# Altium project pca10005.PrjPCB
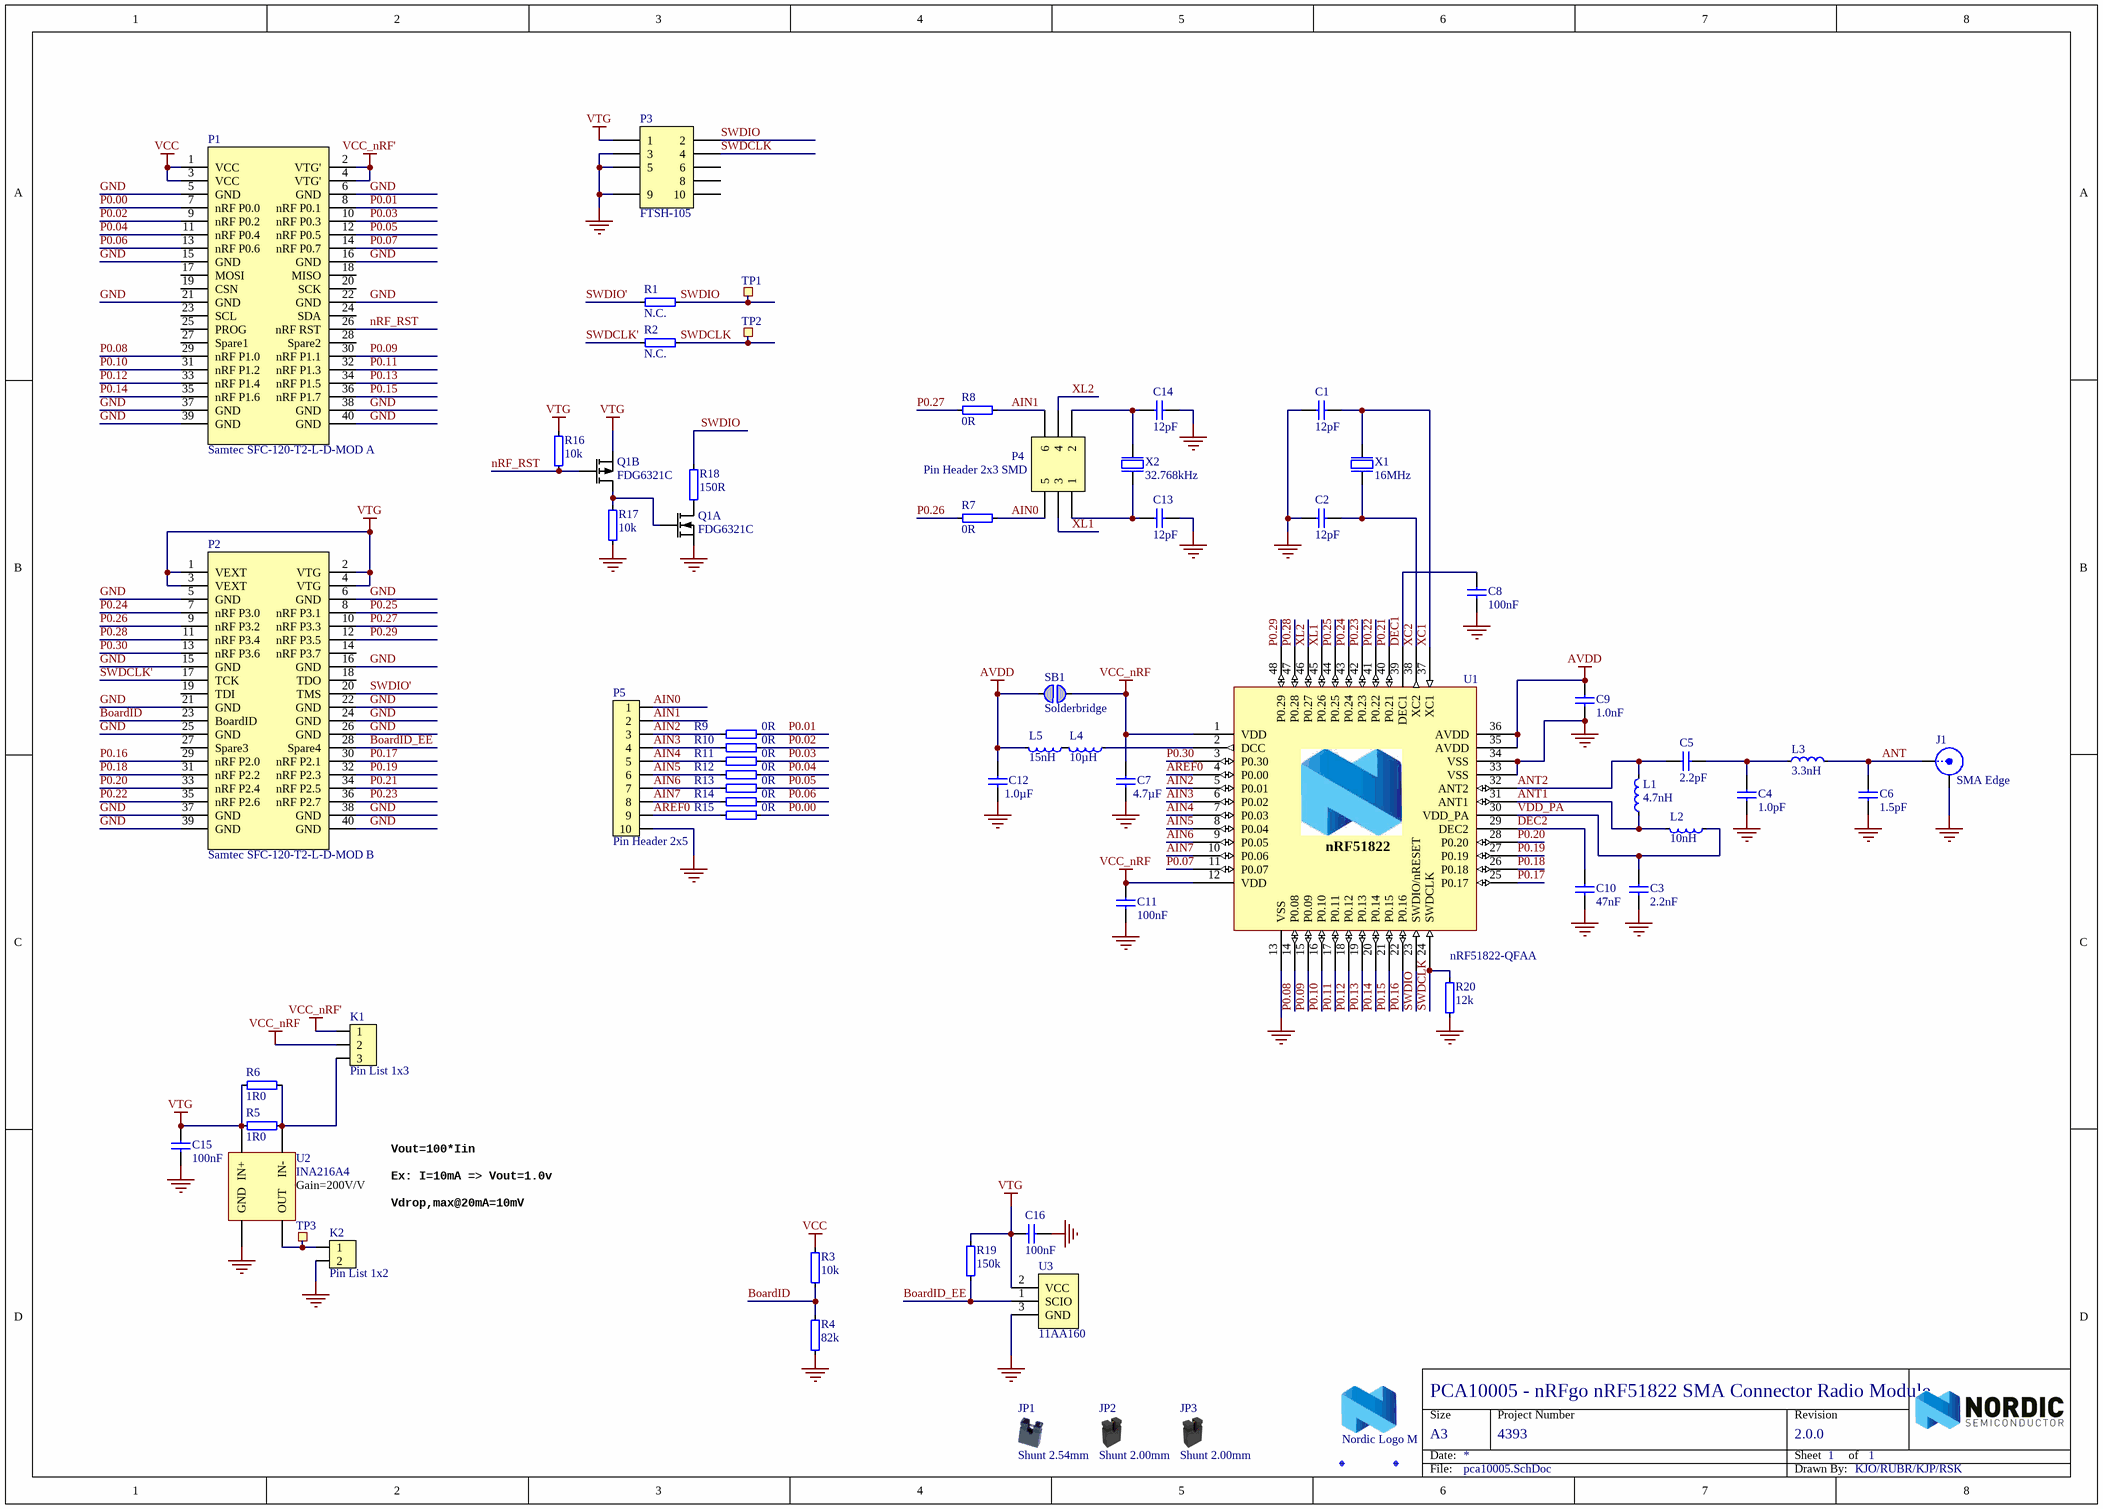
[diagram p0: pca10005.SchDoc]
1 sheet, 65 parts. Net scope: global (net labels, ports and power ports of the same name join across sheets).
Board file: 400006.PcbDoc

## Sheet pca10005.SchDoc: PCA10005 - nRFgo nRF51822 SMA Connector Radio Module
size A3; Revision: 2.0.0; SheetNumber: 1; SheetTotal: 1; DrawnBy: KJO/RUBR/KJP/RSK; ProjectNumber: 4393; DocumentSize: A3; PCBRevision: 0055RSK; PCBNumber: 400006; PCAName: PCA10005

### Parts
C1  12pF  [CAPC1005X04L]
C2  12pF  [CAPC1005X04L]
C3  2.2nF  [CAPC1005X04L]
C4  1.0pF  [CAPC1005X04L]
C5  2.2pF  [CAPC1005X04L]
C6  1.5pF  [CAPC1005X04L]
C7  4.7µF  [CAPC1608X06L]
C8  100nF  [CAPC1005X04L]
C9  1.0nF  [CAPC1005X04L]
C10  47nF  [CAPC1005X04L]
C11  100nF  [CAPC1005X04L]
C12  1.0µF  [CAPC1608X06L]
C13  12pF  [CAPC1005X04L]
C14  12pF  [CAPC1005X04L]
C15  100nF  [CAPC1005X04L]
C16  100nF  [CAPC1005X04L]
Fid1  Fiducial mark  [Fiducial]  (value not drawn)
Fid2  Fiducial mark  [Fiducial]  (value not drawn)
J1  SMA Edge  [SMA-Edge]
JP1  Shunt 2.54mm  [Shunt_2.54mm]
JP2  Shunt 2.00mm  [Shunt_2.00mm]
JP3  Shunt 2.00mm  [Shunt_2.00mm]
K1  Pin List 1x3  [LIST_1x3]
K2  Pin List 1x2  [LIST_1x2]
L1  4.7nH  [INDC1005X04L]
L2  10nH  [INDC1005X04L]
L3  3.3nH  [INDC1005X04L]
L4  10µH  [INDC1608X06L]
L5  15nH  [INDC1005X04L]
LOGO  Nordic Logo M  [NORDIC_LOGO_M]  (no BOM)
P1  Samtec SFC-120-T2-L-D-MOD A  [Samtec SFC-120-T2-L-D]
P2  Samtec SFC-120-T2-L-D-MOD B  [Samtec SFC-120-T2-L-D]
P3  FTSH-105  [HDR_2x5-SMD-1.27mm-SWD]
P4  Pin Header 2x3 SMD  [HDR-2x3-SMD-2.0mm]
P5  Pin Header 2x5  [HDR_2x5]
Q1  FDG6321C  [SC70-6]  (parts A,B of 2)
R1  N.C.  [RESC1005X04L]
R2  N.C.  [RESC1005X04L]
R3  10k  [RESC1005X04L]
R4  82k  [RESC1005X04L]
R5  1R0  [RESC1005X04L]
R6  1R0  [RESC1005X04L]
R7  0R  [RESC1005X04L]
R8  0R  [RESC1005X04L]
R9  0R  [RESC1005X04L]
R10  0R  [RESC1005X04L]
R11  0R  [RESC1005X04L]
R12  0R  [RESC1005X04L]
R13  0R  [RESC1005X04L]
R14  0R  [RESC1005X04L]
R15  0R  [RESC1005X04L]
R16  10k  [RESC1005X04L]
R17  10k  [RESC1005X04L]
R18  150R  [RESC1005X04L]
R19  150k  [RESC1005X04L]
R20  12k  [RESC1005X04L]
SB1  Solderbridge  [Solderbridge]  (no BOM)
TP1  SWDIO  [TP_SMD_1.0mmX1.0mm]  (value not drawn)  (no BOM)
TP2  SWDCLK  [TP_SMD_1.0mmX1.0mm]  (value not drawn)  (no BOM)
TP3  1.0mm,SMD  [TP_SMD_1.0mmX1.0mm]  (value not drawn)  (no BOM)
U1  nRF51822-QFAA  [QFN40P600X600X90-48N]
U2  INA216A4  [BGA4C40P2X2_76X76X62]
U3  11AA160  [SOT-23a]
X1  16MHz  [BT-XTAL_2520]
X2  32.768kHz  [FC-135]

### Nets
AVDD: C9.1 C12.1 L5.2 SB1.2 U1.35(AVDD) U1.36(AVDD)
GND: C1.2 C2.2 C3.2 C4.2 C6.2 C7.2 C8.2 C9.2 C10.2 C11.2 C12.2 C13.2 C14.2 C15.2 C16.2 J1.2(Y) K2.2 P1.5(GND) P1.6(GND) P1.15(GND) P1.16(GND) P1.21(GND) P1.22(GND) P1.37(GND) P1.38(GND) P1.39(GND) P1.40(GND) P2.5(GND) P2.6(GND) P2.15(GND) P2.16(GND) P2.21(GND) P2.22(GND) P2.24(GND) P2.25(GND) P2.26(GND) P2.37(GND) P2.38(GND) P2.39(GND) P2.40(GND) P3.3 P3.5 P3.9 P5.10 Q1.1(S1) R4.1 R17.2 R20.2 U1.13(VSS) U1.33(VSS) U1.34(VSS) U1.49 U2.B1(GND) U3.3(GND) X1.2(GND) X1.4(GND)
VCC: P1.1(VCC) P1.3(VCC) R3.2
VCC_nRF: C7.1 C11.1 K1.2 SB1.1 U1.1(VDD) U1.12(VDD)
VCC_nRF': K1.1 P1.2(VTG') P1.4(VTG')
VTG: C15.1 C16.1 P2.1(VEXT) P2.2(VTG) P2.3(VEXT) P2.4(VTG) P3.1 Q1.4(S2) R5.2 R6.2 R16.1 R19.2 U2.A1(IN+) U3.2(VCC)
AIN0: P4.5 P5.1 R7.2
AIN1: P4.6 P5.2 R8.2
AIN2: P5.3 R9.1 U1.5(P0.01)
AIN3: P5.4 R10.1 U1.6(P0.02)
AIN4: P5.5 R11.1 U1.7(P0.03)
AIN5: P5.6 R12.1 U1.8(P0.04)
AIN6: P5.7 R13.1 U1.9(P0.05)
AIN7: P5.8 R14.1 U1.10(P0.06)
ANT: C6.1 J1.1(X) L3.2
ANT1: L1.1 L2.2 U1.31(ANT1)
ANT2: C5.1 L1.2 U1.32(ANT2)
AREF0: P5.9 R15.1 U1.4(P0.00)
BoardID: P2.23(BoardID) R3.1 R4.2
BoardID_EE: P2.28(Spare4) R19.1 U3.1(SCIO)
DEC1: C8.1 U1.39(DEC1)
DEC2: C10.1 U1.29(DEC2)
nRF_RST: P1.26(nRF_RST) Q1.5(G2) R16.2
P0.00: P1.7(nRF_P0.0) R15.2
P0.01: P1.8(nRF_P0.1) R9.2
P0.02: P1.9(nRF_P0.2) R10.2
P0.03: P1.10(nRF_P0.3) R11.2
P0.04: P1.11(nRF_P0.4) R12.2
P0.05: P1.12(nRF_P0.5) R13.2
P0.06: P1.13(nRF_P0.6) R14.2
P0.07: P1.14(nRF_P0.7) U1.11(P0.07)
P0.08: P1.29(nRF_P1.0) U1.14(P0.08)
P0.09: P1.30(nRF_P1.1) U1.15(P0.09)
P0.10: P1.31(nRF_P1.2) U1.16(P0.10)
P0.11: P1.32(nRF_P1.3) U1.17(P0.11)
P0.12: P1.33(nRF_P1.4) U1.18(P0.12)
P0.13: P1.34(nRF_P1.5) U1.19(P0.13)
P0.14: P1.35(nRF_P1.6) U1.20(P0.14)
P0.15: P1.36(nRF_P1.7) U1.21(P0.15)
P0.16: P2.29(nRF_P2.0) U1.22(P0.16)
P0.17: P2.30(nRF_P2.1) U1.25(P0.17)
P0.18: P2.31(nRF_P2.2) U1.26(P0.18)
P0.19: P2.32(nRF_P2.3) U1.27(P0.19)
P0.20: P2.33(nRF_P2.4) U1.28(P0.20)
P0.21: P2.34(nRF_P2.5) U1.40(P0.21)
P0.22: P2.35(nRF_P2.6) U1.41(P0.22)
P0.23: P2.36(nRF_P2.7) U1.42(P0.23)
P0.24: P2.7(nRF_P3.0) U1.43(P0.24)
P0.25: P2.8(nRF_P3.1) U1.44(P0.25)
P0.26: P2.9(nRF_P3.2) R7.1
P0.27: P2.10(nRF_P3.3) R8.1
P0.28: P2.11(nRF_P3.4) U1.47(P0.28)
P0.29: P2.12(nRF_P3.5) U1.48(P0.29)
P0.30: P2.13(nRF_P3.6) U1.3(P0.30)
SWDCLK: P3.4 R2.1 R20.1 TP2.1 U1.24(SWDCLK)
SWDCLK': P2.17(TCK) R2.2
SWDIO: P3.2 R1.1 R18.1 TP1.1 U1.23(SWDIO/nRESET)
SWDIO': P2.20(TMS) R1.2
VDD_PA: C3.1 L2.1 U1.30(VDD_PA)
XC1: C1.1 U1.37(XC1) X1.1(inp)
XC2: C2.1 U1.38(XC2) X1.3(out)
XL1: P4.3 U1.45(P0.26)
XL2: P4.4 U1.46(P0.27)
NetC4_1: C4.1 C5.2 L3.1
NetC13_1: C13.1 P4.1 X2.2(out)
NetC14_1: C14.1 P4.2 X2.1(inp)
NetK1_3: K1.3 R5.1 R6.1 U2.A2(IN-)
NetK2_1: K2.1 TP3.1 U2.B2(OUT)
NetL4_1: L4.1 U1.2(DCC)
NetL4_2: L4.2 L5.1
NetQ1_2: Q1.2(G1) Q1.3(D2) R17.1
NetQ1_6: Q1.6(D1) R18.2

Not connected (* = marked no-connect by the designer): P1 17(MOSI) 18(MISO) 19(CSN) 20(SCK) 23(SCL) 24(SDA) 25(PROG) 27(Spare1) 28(Spare2); P2 14(nRF_P3.7) 18(TDO) 19(TDI) 27(Spare3); P3 6 8 10

### Notes on the sheet
- (near U2) Gain=200V/V
- Vout=100*Iin
  Ex: I=10mA => Vout=1.0v
  Vdrop,max@20mA=10mV
- Size
- Date:
- Project Number
- Sheet         of
- Revision
- File:
- Drawn By:
- (in symbol nRF51822-Q48-6x6_DCDC) nRF51822

### Library data of the parts
C1 C2 C13 C14 = C0402-12p: Capacitor, NP0, ±2%; Note: 50V; Artikkelnr Noca: 20029159; Part Number: C0402-12p; Manufacturer: *; Manufacturer Part Number: *; Datasheet: *; Footprint: 0402; LatestRevisionDate: 2011-05-11; Pin Count: 2; Publisher: Nordic Semiconductor; Published: 2009-05-08; Value: 12pF; Supplier: *; Supplier part number: *; 2nd source Supplier: *; 2nd source part number: *
C3 = C0402-2n2: Capacitor, X7R, ±10%; Note: 50V; Artikkelnr Noca: 20039221; Part Number: C0402-2n2; Manufacturer: *; Manufacturer Part Number: *; Datasheet: *; Footprint: 0402; LatestRevisionDate: 2009-11-23; Pin Count: 2; Publisher: Nordic Semiconductor; Published: 2009-05-08; Value: 2.2nF; Supplier: *; Supplier part number: *; 2nd source Supplier: *; 2nd source part number: *
C4 = C0402-1.0p: Capacitor, NP0, ±0.1pF; Note: 50V; Artikkelnr Noca: 20029140; Part Number: C0402-1.0p; Manufacturer: *; Manufacturer Part Number: *; Datasheet: *; Footprint: 0402; LatestRevisionDate: 2009-11-23; Pin Count: 2; Publisher: Nordic Semiconductor; Published: 2009-05-08; Value: 1.0pF; Supplier: *; Supplier part number: *; 2nd source Supplier: *; 2nd source part number: *
C5 = C0402-2.2p: Capacitor, NP0, ±0.1pF; Note: 50V; Artikkelnr Noca: 20029145; Part Number: C0402-2.2p; Manufacturer: *; Manufacturer Part Number: *; Datasheet: *; Footprint: 0402; LatestRevisionDate: 2009-05-08; Pin Count: 2; Publisher: Nordic Semiconductor; Published: 2009-05-08; Value: 2.2pF; Supplier: *; Supplier part number: *; 2nd source Supplier: *; 2nd source part number: *
C6 = C0402-1.5p: Capacitor, NP0, ±0.1pF; Note: 50V; Artikkelnr Noca: 20029139; Part Number: C0402-1.5p; Manufacturer: *; Manufacturer Part Number: *; Datasheet: *; Footprint: 0402; LatestRevisionDate: 2009-11-23; Pin Count: 2; Publisher: Nordic Semiconductor; Published: 2009-05-08; Value: 1.5pF; Supplier: *; Supplier part number: *; 2nd source Supplier: *; 2nd source part number: *
C7 = C0603-4µ7: Capacitor, X5R, ±10%; Note: 6.3V; Artikkelnr Noca: 20069060; Part Number: C0603-4µ7; Manufacturer: *; Manufacturer Part Number: *; Datasheet: *; Footprint: 0603; LatestRevisionDate: 2009-11-23; Pin Count: 2; Publisher: Nordic Semiconductor; Published: 2009-05-08; Value: 4.7µF; Supplier: *; Supplier part number: *; 2nd source Supplier: *; 2nd source part number: *
C8 C11 C15 C16 = C0402-100n: Capacitor, X7R, ±10%; Note: 16V; Artikkelnr Noca: 20039200; Part Number: C0402-100n; Manufacturer: *; Manufacturer Part Number: *; Datasheet: *; Footprint: 0402; LatestRevisionDate: 2009-11-23; Pin Count: 2; Publisher: Nordic Semiconductor; Published: 2009-05-08; Value: 100nF; Supplier: *; Supplier part number: *; 2nd source Supplier: *; 2nd source part number: *
C9 = C0402-1n0: Capacitor, X7R, ±10%; Note: 50V; Artikkelnr Noca: 20039223; Part Number: C0402-1n0; Manufacturer: *; Manufacturer Part Number: *; Datasheet: *; Footprint: 0402; LatestRevisionDate: 2009-11-23; Pin Count: 2; Publisher: Nordic Semiconductor; Published: 2009-05-08; Value: 1.0nF; Supplier: *; Supplier part number: *; 2nd source Supplier: *; 2nd source part number: *
C10 = C0402-47n: Capacitor, X7R, ±10%; Note: Chip Cap 10%; Artikkelnr Noca: 20039389; Part Number: C0402-47n; Manufacturer: *; Manufacturer Part Number: *; Datasheet: *; Footprint: 0402; LatestRevisionDate: 2009-05-08; Pin Count: 2; Publisher: Nordic Semiconductor; Published: 2009-05-08; Value: 47nF; Supplier: *; Supplier part number: *; 2nd source Supplier: *; 2nd source part number: *
C12 = C0603-1µ0: Capacitor, X5R, ±10%; Note: 10V; Artikkelnr Noca: 20039205; Part Number: C0603-1µ0; Manufacturer: *; Manufacturer Part Number: *; Datasheet: *; Footprint: 0603; LatestRevisionDate: 2009-11-23; Pin Count: 2; Publisher: Nordic Semiconductor; Published: 2009-05-08; Value: 1.0µF; Supplier: *; Supplier part number: *; 2nd source Supplier: *; 2nd source part number: *
Fid1 Fid2 = Fid-Mark: Artikkelnr Noca: N.A.; Part Number: Fid-Mark; Manufacturer: *; Manufacturer Part Number: *; Datasheet: *; LatestRevisionDate: 2009-12-12; Pin Count: 1; Publisher: Nordic Semiconductor; Published: 2009-12-12; Value: *; Note: *; Supplier: *; Supplier part number: *; 2nd source Supplier: *; 2nd source part number: *
J1 = SMA-Edge-Con: SMA Edge connector; Artikkelnr Noca: 55029004; Part Number: SMA-Edge-Con; Manufacturer: *; Manufacturer Part Number: *; Datasheet: *; Footprint: SMA-EDGE; LatestRevisionDate: 2009-12-12; Pin Count: 2; Publisher: Nordic Semiconductor; Published: 2009-12-12; Value: SMA Edge; Note: *; Supplier: *; Supplier part number: *; 2nd source Supplier: *; 2nd source part number: *
JP1 = SHUNT JUMPER 2.54mm BLACK GOLD: SHUNT JUMPER .1" BLACK GOLD; Manufacturer: 3M; Manufacturer Part Number: 969102-0000-DA; Note: SHUNT JUMPER .1" BLACK GOLD, h=6.00mm, w=5.00mm; Artikkelnr Noca: 56099001; Part Number: SHUNT JUMPER 2.54mm BLACK GOLD; Datasheet: http://www.digikey.com/product-detail/en/969102-0000-DA; Footprint: SHUNT JUMPER 2.54mm; LatestRevisionDate: 2012-07-06; Publisher: Nordic Semiconductor; Published: 2012-07-06; Value: Shunt 2.54mm; Supplier: Digi-Key; Supplier part number: 3M9580-ND; 2nd source Supplier: *; 2nd source part number: *
JP2 JP3 = SHUNT JUMPER 2.00mm BLACK GOLD: SHUNT JUMPER .079" BLACK GOLD; Manufacturer: Sullins Connector Solutions; Manufacturer Part Number: SPN02SXCN-RC; Note: SHUNT JUMPER .079" BLACK GOLD, h=4.50mm, w=4.00mm; Artikkelnr Noca: 56099002; Part Number: SHUNT JUMPER 2.00mm BLACK GOLD; Datasheet: http://www.sullinscorp.com/drawings/275_SXCN_11504.pdf; Footprint: SHUNT JUMPER 2.00mm; LatestRevisionDate: 2012-07-06; Publisher: Nordic Semiconductor; Published: 2012-07-06; Value: Shunt 2.00mm; Supplier: Digi-Key; Supplier part number: S9339-ND; 2nd source Supplier: *; 2nd source part number: *
K1 = Pin List 1x3: Pin List 1x3, 2.54mm (100mil); Artikkelnr Noca: 56019041; Part Number: Pin List 1x3; Manufacturer: *; Manufacturer Part Number: *; Datasheet: *; LatestRevisionDate: 2009-12-12; Pin Count: 3; Publisher: Nordic Semiconductor; Published: 2009-12-12; Value: Pin List 1x3; Note: *; Supplier: *; Supplier part number: *; 2nd source Supplier: *; 2nd source part number: *
K2 = Pin List 1x2: Pin List 1x2, 2.54mm (100mil); Artikkelnr Noca: 56019040; Part Number: Pin List 1x2; Manufacturer: *; Manufacturer Part Number: *; Datasheet: *; LatestRevisionDate: 2009-12-12; Pin Count: 2; Publisher: Nordic Semiconductor; Published: 2009-12-12; Value: Pin List 1x2; Note: *; Supplier: *; Supplier part number: *; 2nd source Supplier: *; 2nd source part number: *
L1 = L0402-4n7: Inductor, 160mA, ±0.1nH; Manufacturer: Murata; Manufacturer Part Number: LQP15MN4N7B02D; Note: High frequency chip inductor ±5%; Artikkelnr Noca: 33029164; Part Number: L0402-4n7; Datasheet: http://search.murata.co.jp/Ceramy/image/img/PDF/ENG/L0075S0084LQP15M.pdf; Footprint: 0402; LatestRevisionDate: 2012-09-19; Pin Count: 2; Publisher: Nordic Semiconductor; Published: 2009-05-08; Value: 4.7nH; Supplier: Digi-Key; Supplier part number: 490-1132-1-ND; 2nd source Supplier: *; 2nd source part number: *
L2 = L0402-10n: Inductor, 100mA, ±2%; Manufacturer: Murata; Manufacturer Part Number: LQP15MN10NG02D; Note: High frequency chip inductor ±5%; Artikkelnr Noca: 33029425; Part Number: L0402-10n; Datasheet: http://search.murata.co.jp/Ceramy/image/img/PDF/ENG/L0075S0084LQP15M.pdf; Footprint: 0402; LatestRevisionDate: 2012-09-19; Pin Count: 2; Publisher: Nordic Semiconductor; Published: 2010-07-12; Value: 10nH; Supplier: Mouser; Supplier part number: 81-LQP15MN10NG02D; 2nd source Supplier: *; 2nd source part number: *
L3 = L0402-3n3: Inductor, 190mA, ±0.1nH; Manufacturer: Murata; Manufacturer Part Number: LQP15MN3N3B02D; Note: High frequency chip inductor ±5%; Artikkelnr Noca: 33029369; Part Number: L0402-3n3; Datasheet: http://search.murata.co.jp/Ceramy/image/img/PDF/ENG/L0075S0084LQP15M.pdf; Footprint: 0402; LatestRevisionDate: 2012-09-19; Pin Count: 2; Publisher: Nordic Semiconductor; Published: 2009-05-08; Value: 3.3nH; Supplier: Digi-Key; Supplier part number: 490-1130-1-ND; 2nd source Supplier: *; 2nd source part number: *
L4 = L0603-10µ: Inductor, 80mA, ±10%; Manufacturer: Taiyo Yuden; Manufacturer Part Number: LBMF1608T100K; 2nd source part number: 178-6105; Note: LBMF1608T100K 10µH 80mA 0603; Artikkelnr Noca: 33029314; Part Number: L0603-10µ; Datasheet: http://www.yuden.co.jp/ut/product/pdf/elb2_e.pdf; Footprint: 0603; LatestRevisionDate: 2012-09-19; Pin Count: 2; Publisher: Nordic Semiconductor; Published: 2010-02-24; Value: 10µH; Supplier: Digi-Key; Supplier part number: 587-1714-1-ND; 2nd source Supplier: Farnell
L5 = L0402-15n: Inductor, 320mA, ±5%; Manufacturer: Taiyo Yuden; Manufacturer Part Number: HK100515NJ-T; 2nd source part number: 658-1328; Note: High frequency chip inductor ±10%; Artikkelnr Noca: 33029323; Part Number: L0402-15n; Footprint: 0402; LatestRevisionDate: 2012-09-19; Pin Count: 2; Publisher: Nordic Semiconductor; Published: 2010-07-12; Value: 15nH; Supplier: Digi-Key; Datasheet: http://www.yuden.co.jp/productdata/catalog/en/mlci04_e.pdf; Supplier part number: 587-1521-1-ND; 2nd source Supplier: Farnell
LOGO = Nordic Logo M: Nordic Logo, medium size; Artikkelnr Noca: N.A.; Part Number: Nordic Logo M; Manufacturer: *; Manufacturer Part Number: *; Datasheet: *; LatestRevisionDate: 2010-02-18; Pin Count: 2; Publisher: Nordic Semiconductor; Published: 2010-02-18; Value: Nordic Logo M; Note: *; Supplier: *; Supplier part number: *; 2nd source Supplier: *; 2nd source part number: *
P1 = Samtec SFC-120-T2-L-D-MOD A: 1.27mm Pitch DIL Vertical SMT Socket Assembly, location pegs, double polarised, gold, 20+20-way; Note: Mates with nRF6310; Artikkelnr Noca: 55019100; Value: Samtec SFC-120-T2-L-D-MOD A; Part Number: Samtec SFC-120-T2-L-D-MOD A; Manufacturer: Samtec; Manufacturer Part Number: SFC-120-T2-L-D; Datasheet: http://www.samtec.com/documents/webfiles/cpdf/Sfc-mkt.pdf; LatestRevisionDate: 2010-02-26; Publisher: Nordic Semiconductor; Published: 2010-02-26; Supplier: Farnell; Supplier part number: 176-3459; 2nd source Supplier: *; 2nd source part number: *
P2 = Samtec SFC-120-T2-L-D-MOD B: 1.27mm Pitch DIL Vertical SMT Socket Assembly, location pegs, double polarised, gold, 20+20-way; Note: Mates with nRF6310; Artikkelnr Noca: 55019100; Value: Samtec SFC-120-T2-L-D-MOD B; Part Number: Samtec SFC-120-T2-L-D-MOD B; Manufacturer: Samtec; Manufacturer Part Number: SFC-120-T2-L-D; Datasheet: http://www.samtec.com/documents/webfiles/cpdf/Sfc-mkt.pdf; LatestRevisionDate: 2010-02-26; Publisher: Nordic Semiconductor; Published: 2010-02-26; Supplier: Farnell; Supplier part number: 176-3459; 2nd source Supplier: *; 2nd source part number: *
P3 = Samtec Micro Header 10 - SWD: SAMTEC - FTSH-105-01-L-DV - HEADER, 1.27MM, SMD, 10WAY; Artikkelnr Noca: 55019196; Part Number: Samtec Micro Header 10 - SWD; Manufacturer: Samtec; Manufacturer Part Number: FTSH-105-01-L-DV; Datasheet: http://www.farnell.com/datasheets/81359.pdf; LatestRevisionDate: 2010-11-25; Publisher: Nordic Semiconductor; Published: 2010-11-25; Value: FTSH-105; Note: HEADER, 1.27MM, SMD, 10WAY; Supplier: Farnell; Supplier part number: 166-7759; 2nd source Supplier: *; 2nd source part number: *
P4 = Pin Header 2x3 SMD 2.0mm: Pin Header 2x3, SMD, 2.0mm; Manufacturer: Sullins Connector Solutions; Manufacturer Part Number: NRPN032MAMP-RC; Artikkelnr Noca: 55019103; Part Number: Pin Header 2x3 SMD 2.0mm; Datasheet: http://www.sullinscorp.com/catalogs/74_Page74-75_HEADER_.079_2mm_MALE.pdf; LatestRevisionDate: 2010-02-24; Pin Count: 6; Publisher: Nordic Semiconductor; Published: 2010-02-24; Value: Pin Header 2x3 SMD; Note: *; Supplier: Digi-Key; Supplier part number: S6008-03-ND; 2nd source Supplier: *; 2nd source part number: *
P5 = Pin Header 2x5: Pin Header 2x5, 2.54mm (100mil); Artikkelnr Noca: 56019114; Part Number: Pin Header 2x5; Manufacturer: *; Manufacturer Part Number: *; Datasheet: *; LatestRevisionDate: 2009-12-12; Pin Count: 10; Publisher: Nordic Semiconductor; Published: 2009-12-12; Value: Pin Header 2x5; Note: *; Supplier: *; Supplier part number: *; 2nd source Supplier: *; 2nd source part number: *
Q1 = FDG6321C: Fairchild, FDG6321C, Dual N & P Channel Digital FET; 2nd source part number: FDG6321CCT-ND; Artikkelnr Noca: 35029089; Part Number: FDG6321C; Manufacturer: Fairchild; Manufacturer Part Number: FDG6321C; Datasheet: http://www.fairchildsemi.com/ds/FD/FDG6321C.pdf; LatestRevisionDate: 2011-05-11; Pin Count: 6; Publisher: Nordic Semiconductor; Published: 2009-09-16; Value: FDG6321C; Note: Dual N & P Channel Digital FET; Supplier: Farnell; Supplier part number: 338-0324; 2nd source Supplier: Digi-Key
R1 R2 = R0402-N.C.: Not mounted; Note: Chip Res; Artikkelnr Noca: N.A.; Part Number: R0402-N.C.; Manufacturer: *; Manufacturer Part Number: *; Datasheet: *; Footprint: 0402; LatestRevisionDate: 2009-05-08; Pin Count: 2; Publisher: Nordic Semiconductor; Published: 2009-05-08; Value: N.C.; Supplier: *; Supplier part number: *; 2nd source Supplier: *; 2nd source part number: *
R3 R16 R17 = R0402-10k: Resistor, ±1%, 0.063W; Note: Chip Res 1%; Artikkelnr Noca: 27049097; Part Number: R0402-10k; Manufacturer: *; Manufacturer Part Number: *; Datasheet: *; Footprint: 0402; LatestRevisionDate: 2009-11-23; Pin Count: 2; Publisher: Nordic Semiconductor; Published: 2009-05-08; Value: 10k; Supplier: Farnell; Supplier part number: 173-8864; 2nd source Supplier: *; 2nd source part number: *
R4 = R0402-82k: Resistor, ±1%, 0.063W; Note: Chip Res 1%; Artikkelnr Noca: 27049119; Part Number: R0402-82k; Manufacturer: *; Manufacturer Part Number: *; Datasheet: *; Footprint: 0402; LatestRevisionDate: 2009-11-23; Pin Count: 2; Publisher: Nordic Semiconductor; Published: 2009-05-08; Value: 82k; Supplier: Farnell; Supplier part number: 173-8876; 2nd source Supplier: *; 2nd source part number: *
R5 R6 = R0402-1R0: Resistor, ±1%, 0.063W; Note: Chip Res 1%; Artikkelnr Noca: 27049001; Part Number: R0402-1R0; Manufacturer: *; Manufacturer Part Number: *; Datasheet: *; Footprint: 0402; LatestRevisionDate: 2012-06-22; Pin Count: 2; Publisher: Nordic Semiconductor; Published: 2012-06-22; Value: 1R0; Supplier: *; Supplier part number: *; 2nd source Supplier: *; 2nd source part number: *
R7-R15 = R0402-0R: Resistor, ±5%, 0.063W; Note: Chip Res 5%; Artikkelnr Noca: 27049000; Part Number: R0402-0R; Manufacturer: *; Manufacturer Part Number: *; Datasheet: *; Footprint: 0402; LatestRevisionDate: 2009-11-23; Pin Count: 2; Publisher: Nordic Semiconductor; Published: 2009-05-08; Value: 0R; Supplier: Farnell; Supplier part number: 146-9661; 2nd source Supplier: *; 2nd source part number: *
R18 = R0402-150: Resistor, ±1%, 0.063W; Note: Chip Res 1%; Artikkelnr Noca: 27049053; Part Number: R0402-150; Manufacturer: *; Manufacturer Part Number: *; Datasheet: *; Footprint: 0402; LatestRevisionDate: 2009-11-23; Pin Count: 2; Publisher: Nordic Semiconductor; Published: 2009-05-08; Value: 150R; Supplier: Farnell; Supplier part number: 173-8839; 2nd source Supplier: *; 2nd source part number: *
R19 = R0402-150k: Resistor, ±1%, 0.063W; Note: Chip Res 1%; Artikkelnr Noca: 27049125; Part Number: R0402-150k; Manufacturer: *; Manufacturer Part Number: *; Datasheet: *; Footprint: 0402; LatestRevisionDate: 2009-11-23; Pin Count: 2; Publisher: Nordic Semiconductor; Published: 2009-05-08; Value: 150k; Supplier: Farnell; Supplier part number: 165-2753; 2nd source Supplier: *; 2nd source part number: *
R20 = R0402-12k: Resistor, ±1%, 0.063W; Note: Chip Res 1%; Artikkelnr Noca: 27049099; Part Number: R0402-12k; Manufacturer: *; Manufacturer Part Number: *; Datasheet: *; Footprint: 0402; LatestRevisionDate: 2009-11-23; Pin Count: 2; Publisher: Nordic Semiconductor; Published: 2009-05-08; Value: 12k; Supplier: Farnell; Supplier part number: 173-8865; 2nd source Supplier: *; 2nd source part number: *
SB1 = Solderbridge: Artikkelnr Noca: N.A.; Part Number: Solderbridge; Manufacturer: *; Manufacturer Part Number: *; Datasheet: *; LatestRevisionDate: 2009-12-14; Pin Count: 2; Publisher: Nordic Semiconductor; Published: 2009-12-14; Value: Solderbridge; Note: *; Supplier: *; Supplier part number: *; 2nd source Supplier: *; 2nd source part number: *
TP1 TP2 = TP_SMD_1.0MM: Regular Plated, 1.0mm hole; Manufacturer: Nordic Semiconductor; Value: 1.0mm,SMD; Artikkelnr Noca: N.A.; Part Number: TP_SMD_1.0MM; Manufacturer Part Number: *; Datasheet: *; LatestRevisionDate: 2009-12-12; Pin Count: 1; Publisher: Nordic Semiconductor; Published: 2009-12-12; Note: Regular Plated, 1.0mm hole; Supplier: *; Supplier part number: *; 2nd source Supplier: *; 2nd source part number: *
TP3 = TP_SMD_1.0MM: Regular Plated, 1.0mm hole; Manufacturer: Nordic Semiconductor; Artikkelnr Noca: N.A.; Part Number: TP_SMD_1.0MM; Manufacturer Part Number: *; Datasheet: *; LatestRevisionDate: 2009-12-12; Pin Count: 1; Publisher: Nordic Semiconductor; Published: 2009-12-12; Value: 1.0mm,SMD; Note: Regular Plated, 1.0mm hole; Supplier: *; Supplier part number: *; 2nd source Supplier: *; 2nd source part number: *
U1 = nRF51822-Q48-6x6_DCDC: Multi-protocol Bluetooth Low Energy and 2.4GHz proprietary system-on-chip; Manufacturer: Nordic Semiconductor; Note: nRF51822 - QFN48 6x6 0.4mm pitch; Artikkelnr Noca: 15079200; Part Number: nRF51822-Q48-6x6_DCDC; Manufacturer Part Number: nRF51822-QFAA; Datasheet: *; Footprint: QFN-48; LatestRevisionDate: 2012-07-10; Pin Count: 48; Publisher: Nordic Semiconductor; Published: 2012-07-08; Value: nRF51822-QFAA; Supplier: Nordic Semiconductor; Supplier part number: *; 2nd source Supplier: *; 2nd source part number: *
U2 = INA216A4: TEXAS INSTRUMENTS - INA216A4YFFT - IC, CURRENT SHUNT MONITOR, 4DSBGA; 2nd source part number: 186-3102; Note: Gain 200V/V; Artikkelnr Noca: 17049269; Part Number: INA216A4; Manufacturer: Texas Instruments; Manufacturer Part Number: INA216A4YFFT; Datasheet: http://www.ti.com/lit/ds/symlink/ina216a4.pdf; Footprint: WCSP-4; LatestRevisionDate: 2012-07-04; Pin Count: 4; Publisher: Nordic Semiconductor; Published: 2012-07-04; Value: INA216A4; Supplier: Digi-Key; Supplier part number: 296-28104-1-ND; 2nd source Supplier: Farnell
U3 = 11AA160T-I/TT: MICROCHIP - 11AA160T-I/TT - IC, EEPROM, 16K, 1.8V, UNIO, SOT-23; 2nd source part number: 157-8309; Artikkelnr Noca: 15029483; Part Number: 11AA160T-I/TT; Manufacturer: Microchip; Manufacturer Part Number: 11AA160T-I/TT; Datasheet: http://ww1.microchip.com/downloads/en/DeviceDoc/DS-22067D.pdf; Footprint: SOT-23; LatestRevisionDate: 2012-01-10; Pin Count: 3; Publisher: Nordic Semiconductor; Published: 2012-01-10; Value: 11AA160; Note: EEPROM, 16K, 1.8V, UNIO, SOT-23; Supplier: Digi-Key; Supplier part number: 11AA160T-I/TTCT-ND; 2nd source Supplier: Farnell
X1 = NX2520SA-16MHZ-STD-CSW-5: XTAL SMD 2520, 16MHz, 8pF, ±15ppm; Manufacturer: NDK; Note: XTAL SMD 16.000MHz; Artikkelnr Noca: 22019192; Part Number: NX2520SA-16MHZ-STD-CSW-5; Manufacturer Part Number: NX2520SA-16MHZ-STD-CSW-5; Datasheet: http://www.ndk.com/images/products/catalog/c_NX2520SA-STD-CSW-5_e.pdf; LatestRevisionDate: 2012-06-15; Pin Count: 4; Publisher: Nordic Semiconductor; Published: 2012-06-15; Value: 16MHz; Supplier: Digi-Key; Supplier part number: 644-1169-1-ND; 2nd source Supplier: *; 2nd source part number: *
X2 = XTAL_FC-135 32.768k: EPSON TOYOCOM - FC-135 32.768KHZ ±20PPM,9.0PF - CRYSTAL, SM, WATCH; 2nd source part number: 127-8037; Note: XTAL SMD 32.768kHz, 3215; Artikkelnr Noca: 22019091; Part Number: XTAL_FC-135 32.768k; Manufacturer: Epson Toyocom; Manufacturer Part Number: FC-135 32.768KHZ ±20PPM,9.0PF; Datasheet: http://www.farnell.com/datasheets/57480.pdf; LatestRevisionDate: 2010-10-18; Pin Count: 2; Publisher: Nordic Semiconductor; Published: 2010-10-18; Value: 32.768kHz; Supplier: Digi-Key; Supplier part number: FC-135 32.7680KA-AC-ND; 2nd source Supplier: Farnell